# EAGLE schematic SwitchedPowerAdapter (EAGLE 9.2.1)
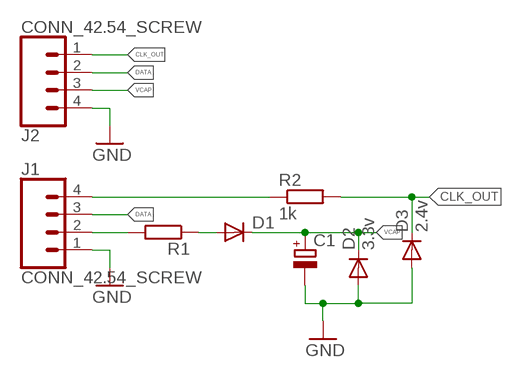
[diagram p0: schematic, sheet 1]

## Parts
C1  CPOL-EUHL  [HL]
D1  DIODEDO-214AC  [DO214AC]
D2  3.3v  DIODESOD-123  [SOD-123]
D3  2.4v  DIODESOD-123  [SOD-123]
J1  CONN_42.54_SCREW  [1X04_SCREW]
J2  CONN_42.54_SCREW  [1X04_SCREW]
R1  R-EU_R2512  [R2512]
R2  1k  R-EU_R0402  [R0402]

## Nets
CLK: J1.4 R2.1
CLK_OUT: D3.CAT(C) J2.1 R2.2
DATA: J1.3 J2.2
GND: C1.- D2.ANODE(A) D3.ANODE(A) J1.1 J2.4
N$1: J1.2 R1.2
N$2: D1.A R1.1
VCAP: C1.+ D1.C D2.CAT(C) J2.3

## Library data of the parts
C1 = bschulz_passives:CPOL-EU: POLARIZED CAPACITOR, European symbol
D1 = bschulz:DIODE: Genaric Diode; DIGIKEY: S1AFSCT-ND; MF: On Semiconductor; MPN: S1A
D2 = bschulz:DIODE: Genaric Diode; DIGIKEY: MMSZ4683-HE3-08GICT-ND; MF: Vishay; MPN: MMSZ4683-HE3-08
D3 = bschulz:DIODE: Genaric Diode
J1 J2 = bschulz:CONN_4: Genaric 4 pin connector; DIGIKEY: ED10563-ND; MF: On Shore; MPN: OSTVN04A150
R1 = bschulz_passives:R-EU_: RESISTOR, European symbol Digikey Parts: Yageo, 0402 <https://www.digikey.com/products/en/resistors/chip-resistor-surface-mount/52?k=&pkeyword=&sf=0&FV=ffec1104%2Cfffc000d%2C1c0002%2C440067%2C1f140000%2Cffe00034%2C400004&quantity=&ColumnSort=0&page=1&stock=1&pageSize=25> Yageo, 0603 <https://www.digikey.com/products/en/resistors/chip-resistor-surface-mount/52?k=&pkeyword=&s=4356&s=47360&sf=0&FV=fffc000d%2C1c0002%2C142c040c%2C1f140000%2Cffe00034&quantity=10&ColumnSort=1000011&page=1&stock=1&pageSize=25> Panasonic, 0603 <https://www.digikey.com/products/en/resistors/chip-resistor-surface-mount/52?k=&pkeyword=&pv252=68&sf=0&FV=ffec373d%2C1c0002%2C142c040c%2C1f140000%2Cffe00034%2C80002%2Cc0001&quantity=&ColumnSort=0&page=1&stock=1&pageSize=25> Panasonic, precision, 0603 <https://www.digikey.com/products/en/resistors/chip-resistor-surface-mount/52?FV=ffec4907%2Cfffc000a%2Cc0172%2C142c040c%2C1f140000%2Cffe00034%2C1c0002&quantity=100&ColumnSort=2085&page=1&stock=1&pageSize=25> Panasonic, 0805 <https://www.digikey.com/products/en/resistors/chip-resistor-surface-mount/52?k=&pkeyword=&pv3=1&sf=0&FV=ffec373d%2C1c0002%2C1f140000%2Cffe00034%2C142c040d&quantity=&ColumnSort=0&page=1&stock=1&pageSize=25> Rohm, current sense <https://www.digikey.com/products/en/resistors/chip-resistor-surface-mount/52?k=&pkeyword=&pv3=1&sf=0&FV=ffecb688%2C1f140000%2Cffe00034%2C1c0002&quantity=&ColumnSort=0&page=1&stock=1&pageSize=25> Vishay, pulse proof automotive <https://www.digikey.com/products/en/resistors/chip-resistor-surface-mount/52?k=&pkeyword=&pv7=2&sf=0&FV=ffec5d6b%2Cffe00034%2C1f140000&quantity=&ColumnSort=0&page=1&stock=1&pageSize=25>
R2 = bschulz_passives:R-EU_: RESISTOR, European symbol Digikey Parts: Yageo, 0402 <https://www.digikey.com/products/en/resistors/chip-resistor-surface-mount/52?k=&pkeyword=&sf=0&FV=ffec1104%2Cfffc000d%2C1c0002%2C440067%2C1f140000%2Cffe00034%2C400004&quantity=&ColumnSort=0&page=1&stock=1&pageSize=25> Yageo, 0603 <https://www.digikey.com/products/en/resistors/chip-resistor-surface-mount/52?k=&pkeyword=&s=4356&s=47360&sf=0&FV=fffc000d%2C1c0002%2C142c040c%2C1f140000%2Cffe00034&quantity=10&ColumnSort=1000011&page=1&stock=1&pageSize=25> Panasonic, 0603 <https://www.digikey.com/products/en/resistors/chip-resistor-surface-mount/52?k=&pkeyword=&pv252=68&sf=0&FV=ffec373d%2C1c0002%2C142c040c%2C1f140000%2Cffe00034%2C80002%2Cc0001&quantity=&ColumnSort=0&page=1&stock=1&pageSize=25> Panasonic, precision, 0603 <https://www.digikey.com/products/en/resistors/chip-resistor-surface-mount/52?FV=ffec4907%2Cfffc000a%2Cc0172%2C142c040c%2C1f140000%2Cffe00034%2C1c0002&quantity=100&ColumnSort=2085&page=1&stock=1&pageSize=25> Panasonic, 0805 <https://www.digikey.com/products/en/resistors/chip-resistor-surface-mount/52?k=&pkeyword=&pv3=1&sf=0&FV=ffec373d%2C1c0002%2C1f140000%2Cffe00034%2C142c040d&quantity=&ColumnSort=0&page=1&stock=1&pageSize=25> Rohm, current sense <https://www.digikey.com/products/en/resistors/chip-resistor-surface-mount/52?k=&pkeyword=&pv3=1&sf=0&FV=ffecb688%2C1f140000%2Cffe00034%2C1c0002&quantity=&ColumnSort=0&page=1&stock=1&pageSize=25> Vishay, pulse proof automotive <https://www.digikey.com/products/en/resistors/chip-resistor-surface-mount/52?k=&pkeyword=&pv7=2&sf=0&FV=ffec5d6b%2Cffe00034%2C1f140000&quantity=&ColumnSort=0&page=1&stock=1&pageSize=25>; MF: Yageo